# EAGLE design KMO_IO_M (EAGLE 9.1.3)
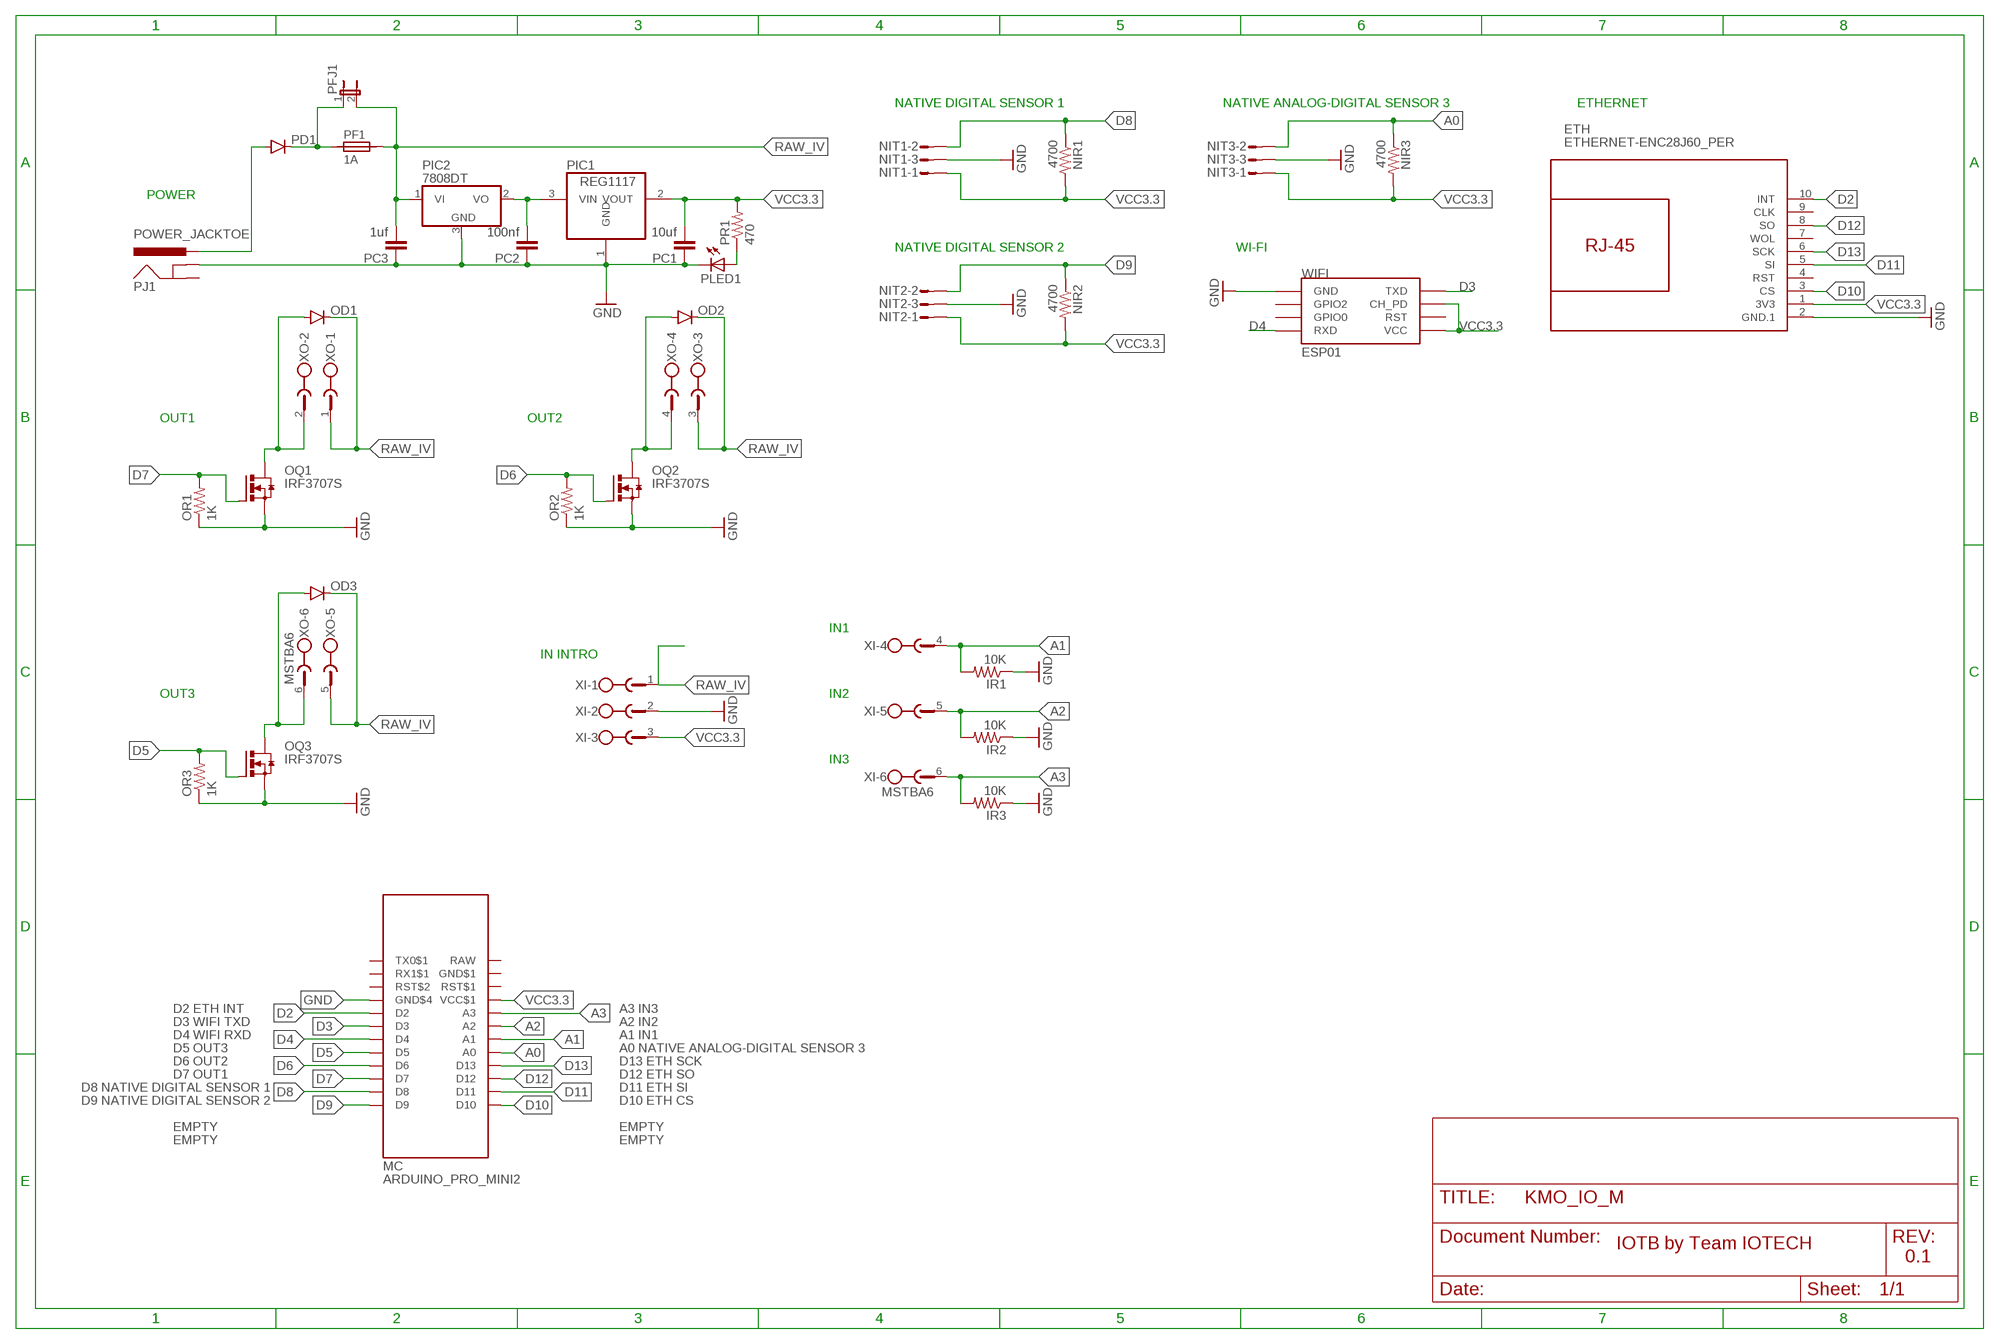
[diagram p0: schematic, sheet 1]

## Parts
ETH  ETHERNET-ENC28J60_PER  [ETHERNET-ENC28J60_PER]
IR1  10K  RESISTOR0805-RES  [0805]
IR2  10K  RESISTOR0805-RES  [0805]
IR3  10K  RESISTOR0805-RES  [0805]
MC  ARDUINO_PRO_MINI2  [ARDUINO_PRO_MINI2]
NIR1  4700  RESISTOR0805-RES  [0805]
NIR2  4700  RESISTOR0805-RES  [0805]
NIR3  4700  RESISTOR0805-RES  [0805]
NIT1  S03P  [S03P]
NIT2  S03P  [S03P]
NIT3  S03P  [S03P]
OD1  DIODESMA  [SMA-DIODE]
OD2  DIODESMA  [SMA-DIODE]
OD3  DIODESMA  [SMA-DIODE]
OQ1  IRF3707S  IRF3704S  [D2PACK]
OQ2  IRF3707S  IRF3704S  [D2PACK]
OQ3  IRF3707S  IRF3704S  [D2PACK]
OR1  1K  RESISTOR0805-RES  [0805]
OR2  1K  RESISTOR0805-RES  [0805]
OR3  1K  RESISTOR0805-RES  [0805]
PC1  10uf  CAP0805  [0805]
PC2  100nf  CAP0805  [0805]
PC3  1uf  CAP0805  [0805]
PD1  DIODESMA  [SMA-DIODE]
PF1  1A  SIBA194600  [1820]
PFJ1  JP1E  [JP1]
PIC1  REG1117  [SOT223]
PIC2  7808DT  [TO252]
PJ1  POWER_JACKTOE  [POWER_JACK_SMD_OVERPASTE_TOE]
PLED1  LEDCHIP-LED0805  [CHIP-LED0805]
PR1  470  RESISTOR0805-RES  [0805]
WIFI  ESP01  [ESP01]
XI  MSTBA6  [MSTBA6]
XO  MSTBA6  [MSTBA6]

## Nets
A0: MC.A0 NIR3.1 NIT3.2
A1: IR1.2 MC.A1 XI.4
A2: IR2.2 MC.A2 XI.5
A3: IR3.2 MC.A3 XI.6
D2: ETH.10(INT) MC.D2
D3: MC.D3 WIFI.TX(TXD)
D4: MC.D4 WIFI.RX(RXD)
D5: MC.D5 OQ3.1(G) OR3.2
D6: MC.D6 OQ2.1(G) OR2.2
D7: MC.D7 OQ1.1(G) OR1.2
D8: MC.D8 NIR1.1 NIT1.2
D9: MC.D9 NIR2.1 NIT2.2
D10: ETH.3(CS) MC.D10
D11: ETH.5(SI) MC.D11
D12: ETH.8(SO) MC.D12
D13: ETH.6(SCK) MC.D13
GND: ETH.2(GND.1) IR1.1 IR2.1 IR3.1 MC.GND$4 NIT1.3 NIT2.3 NIT3.3 OQ1.3(S) OQ2.3(S) OQ3.3(S) OR1.1 OR2.1 OR3.1 PC1.1 PC2.1 PC3.1 PIC1.1(GND) PIC2.3(GND) PJ1.GND(GNDBREAK) PLED1.C WIFI.GND XI.2
N$1: OD3.A OQ3.2(D) XO.6
N$2: PD1.C PF1.1 PFJ1.1
N$3: OD1.A OQ1.2(D) XO.2
N$4: OD2.A OQ2.2(D) XO.4
N$7: PD1.A PJ1.VIN0(PWR)
N$11: PLED1.A PR1.1
N$12: PC2.2 PIC1.3(VIN) PIC2.2(VO)
RAW_IV [v]: OD1.C OD2.C OD3.C PC3.2 PF1.2 PFJ1.2 PIC2.1(VI) XI.1 XO.1 XO.3 XO.5
VCC3.3: ETH.1(3V3) MC.VCC$1 NIR1.2 NIR2.2 NIR3.2 NIT1.1 NIT2.1 NIT3.1 PC1.2 PIC1.2(VOUT) PR1.2 WIFI.CH_PD WIFI.VCC XI.3
Unconnected: ETH.4(RST) ETH.7(WOL) ETH.9(CLK) MC.RST$1 MC.RST$2 MC.RX1$1 MC.TX0$1 PJ1.P$4(GND) WIFI.GPIO0 WIFI.GPIO2 WIFI.RST

## Notes on the sheet
- NATIVE DIGITAL SENSOR 1 | NATIVE ANALOG-DIGITAL SENSOR 3 | ETHERNET
- POWER
- NATIVE DIGITAL SENSOR 2 | WI-FI
- OUT1 | OUT2
- IN1
- IN INTRO
- OUT3 | IN2
- IN3
- D2 ETH INT | A3 IN3
- D3 WIFI TXD | A2 IN2
- D4 WIFI RXD | A1 IN1
- D5 OUT3 | A0 NATIVE ANALOG-DIGITAL SENSOR 3
- D6 OUT2 | D13 ETH SCK
- D7 OUT1 | D12 ETH SO
- D8 NATIVE DIGITAL SENSOR 1 | D11 ETH SI
- D9 NATIVE DIGITAL SENSOR 2 | D10 ETH CS
- EMPTY | EMPTY
- EMPTY | EMPTY
- IOTB by Team IOTECH
- 0.1

## Power pins joined to a net without a drawn wire
GND$1: MC.GDN$1(GND$1)
RAW: MC.RAW

## Library data of the parts
ETH = personal_diy-modules:ETHERNET-ENC28J60_PER
IR1-IR3 NIR1-NIR3 OR1-OR3 PR1 = SparkFun-Passives:RESISTOR: Resistor Basic schematic elements and footprints for 0603, 1206, and PTH resistors.
MC = personal_srgPersonal:ARDUINO_PRO_MINI2
NIT1-NIT3 = con-amp-mt:S03P: AMP MT CONNECTOR; OC_FARNELL: unknown; OC_NEWARK: unknown
OD1-OD3 PD1 = SparkFun-DiscreteSemi:DIODE: Diode These are standard reverse protection diodes and small signal diodes. SMA package can handle up to about 1A. SOD-323 can handle about 200mA. What the SOD-323 package when ordering, there are some mfgs out there that are 5-pin packages.
OQ1-OQ3 = transistor-power:IRF3704: SMPS MOSFET HEXFET® Power MOSFET Source: http://www.irf.com/product-info/datasheets/data/irf3704.pdf
PC1-PC3 = SparkFun-Capacitors:CAP: Capacitor Standard 0603 ceramic capacitor, and 0.1" leaded capacitor.
PF1 = _hhn_PtcFuses_Siba_r500_Ozan:SIBA194600*: SIBA PTC-Fuses, Series 194600, 1812 (4.5 3.2)mm Source: www.siba.de/ Package: SMD 1812 (4.5 x 3.2)mm Technologies: SIBA194600Axxx xxx: Trip-Current * 10 mA Author: Dipl.-Ing. FH Rainer Bayer
PFJ1 = jumper:JP1E: JUMPER
PIC1 = burr-brown:REG1117: 800mA and 1A Low Dropout (LDO) Positive Regulator 1.8V, 2.5V, 2.85V, 3.3V, 5V, and Adj; MPN: REG1117; OC_FARNELL: 1097566; OC_NEWARK: 14P6981
PIC2 = linear:78*: Positive VOLTAGE REGULATOR Source: http://cache.national.com/ds/LM/LM78L05.pdf http://www.fairchildsemi.com/ds/LM/LM7805.pdf
PJ1 = SparkFun-Connectors:POWER_JACK: Power Jack Connector This is the standard 5.5mm barrel jack for power. The PTH is the most common, proven, reliable, footprint. The Slot footprint only works if the mill layer is transmitted to the PCB fab house so be warned. Here are the connectors we sell at SparkFun: DC Barrel Power Jack/Connector <https://www.sparkfun.com/products/119> (PRT-00119) DC Barrel Power Jack/Connector (SMD) <https://www.sparkfun.com/products/12748> (PRT-12748) DC Barrel Jack Adapter - Breadboard Compatible <https://www.sparkfun.com/products/10811> (PRT-10811) It is used on this SparkFun product (and many, many others): SparkFun RedBoard - Programmed with Arduino <https://www.sparkfun.com/products/12757> (DEV-12757) Also, if you need a mating power supply or connector, please check these out: Wall Adapter Power Supply - 9VDC 650mA <https://www.sparkfun.com/products/298> (TOL-00298) DC Barrel Jack Adapter - Male <https://www.sparkfun.com/products/10287> (PRT-10287); PROD_ID: CONN-08106; SF_ID: PRT-12748
PLED1 = led:LED: LED OSRAM: - CHIPLED LG R971, LG N971, LY N971, LG Q971, LY Q971, LO R971, LY R971 LH N974, LH R974 LS Q976, LO Q976, LY Q976 LO Q996 - Hyper CHIPLED LW Q18S LB Q993, LB Q99A, LB R99A - SideLED LS A670, LO A670, LY A670, LG A670, LP A670 LB A673, LV A673, LT A673, LW A673 LH A674 LY A675 LS A676, LA A676, LO A676, LY A676, LW A676 LS A679, LY A679, LG A679 - Hyper Micro SIDELED® LS Y876, LA Y876, LO Y876, LY Y876 LT Y87S - SmartLED LW L88C, LW L88S LB L89C, LB L89S, LG L890 LS L89K, LO L89K, LY L89K LS L896, LA L896, LO L896, LY L896 - TOPLED LS T670, LO T670, LY T670, LG T670, LP T670 LSG T670, LSP T670, LSY T670, LOP T670, LYG T670 LG T671, LOG T671, LSG T671 LB T673, LV T673, LT T673, LW T673 LH T674 LS T676, LA T676, LO T676, LY T676, LB T676, LH T676, LSB T676, LW T676 LB T67C, LV T67C, LT T67C, LS T67K, LO T67K, LY T67K, LW E67C LS E67B, LA E67B, LO E67B, LY E67B, LB E67C, LV E67C, LT E67C LW T67C LS T679, LY T679, LG T679 LS T770, LO T770, LY T770, LG T770, LP T770 LB T773, LV T773, LT T773, LW T773 LH T774 LS E675, LA E675, LY E675, LS T675 LS T776, LA T776, LO T776, LY T776, LB T776 LHGB T686 LT T68C, LB T68C - Hyper Mini TOPLED® LB M676 - Mini TOPLED Santana® LG M470 LS M47K, LO M47K, LY M47K Source: http://www.osram.convergy.de LUXEON: - LUMILED® LXK2-PW12-R00, LXK2-PW12-S00, LXK2-PW14-U00, LXK2-PW14-V00 LXK2-PM12-R00, LXK2-PM12-S00, LXK2-PM14-U00 LXK2-PE12-Q00, LXK2-PE12-R00, LXK2-PE12-S00, LXK2-PE14-T00, LXK2-PE14-U00 LXK2-PB12-K00, LXK2-PB12-L00, LXK2-PB12-M00, LXK2-PB14-N00, LXK2-PB14-P00, LXK2-PB14-Q00 LXK2-PR12-L00, LXK2-PR12-M00, LXK2-PR14-Q00, LXK2-PR14-R00 LXK2-PD12-Q00, LXK2-PD12-R00, LXK2-PD12-S00 LXK2-PH12-R00, LXK2-PH12-S00 LXK2-PL12-P00, LXK2-PL12-Q00, LXK2-PL12-R00 Source: www.luxeon.com KINGBRIGHT: KA-3528ASYC Source: www.kingbright.com
WIFI = esp8266modules:ESP01: ESP8266 Wifi module 01
XI XO = con-phoenix-508:MSTBA6: PHOENIX; MF: FARNELL; MPN: 1757284; OC_FARNELL: 3705213; OC_NEWARK: 71C4165

## Net classes
0 default: width 0.3 mm, drill 0.5 mm, clearance 0.25 mm
1 v: width 0.3 mm, drill 0.5 mm, clearance 0.25 mm

## Board
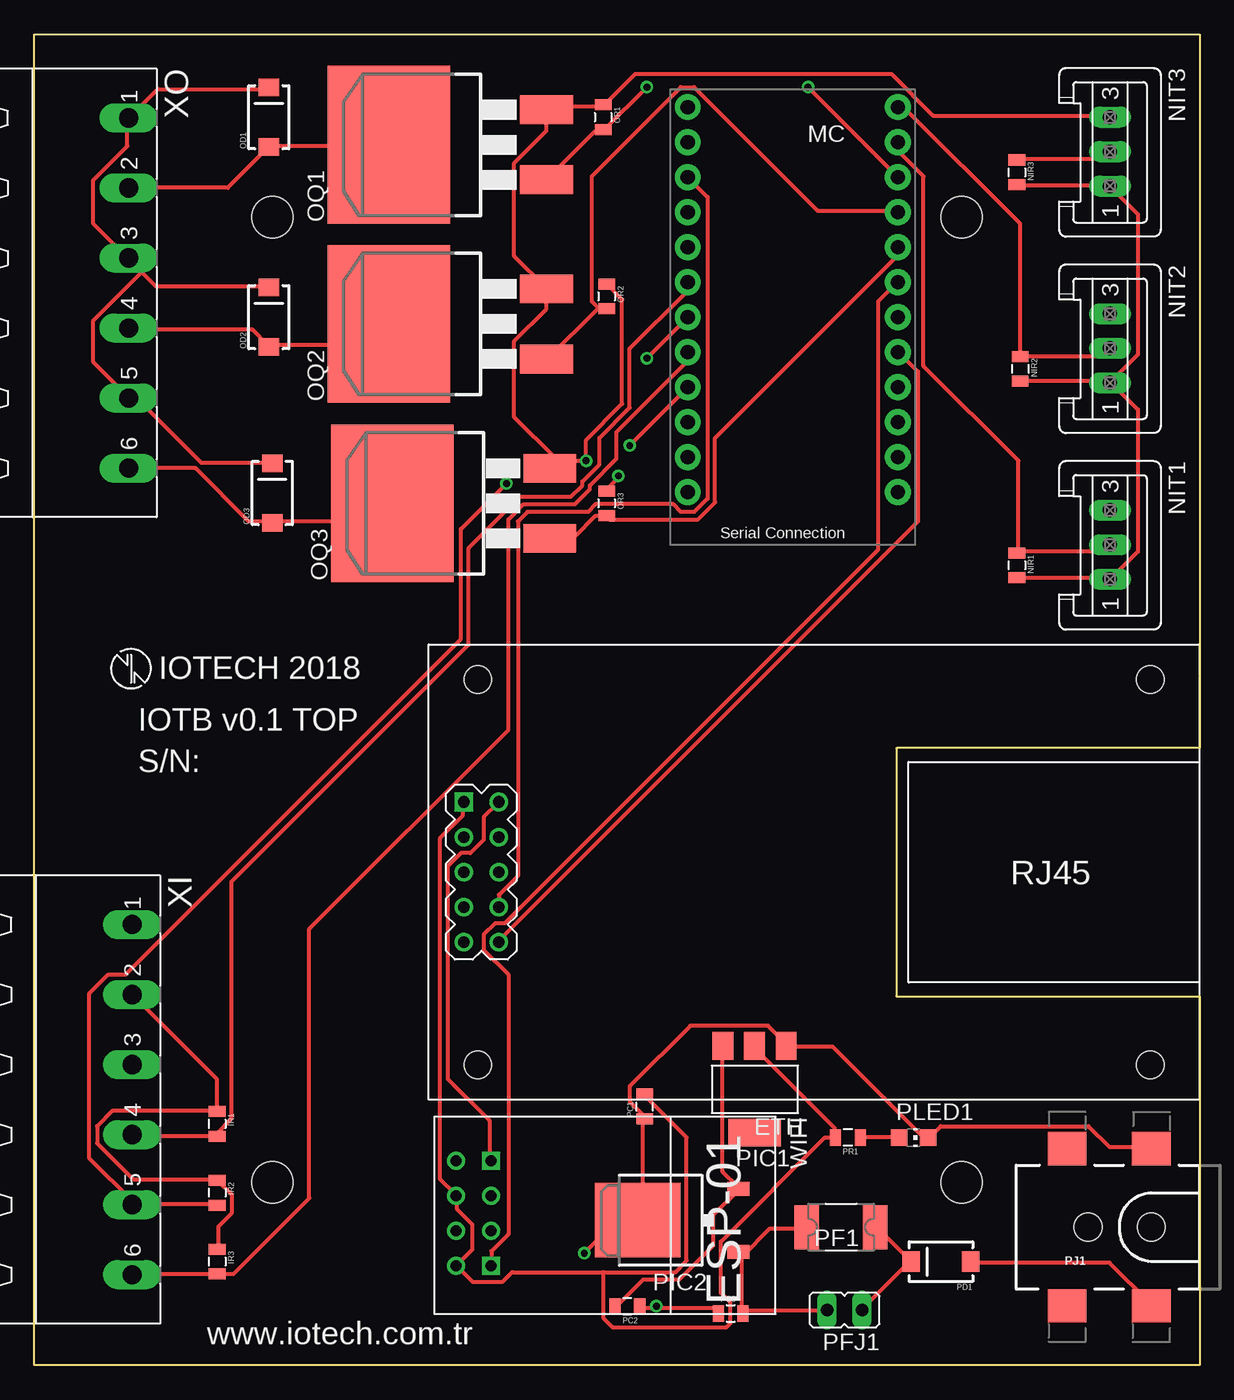
[diagram p1: board, top side]
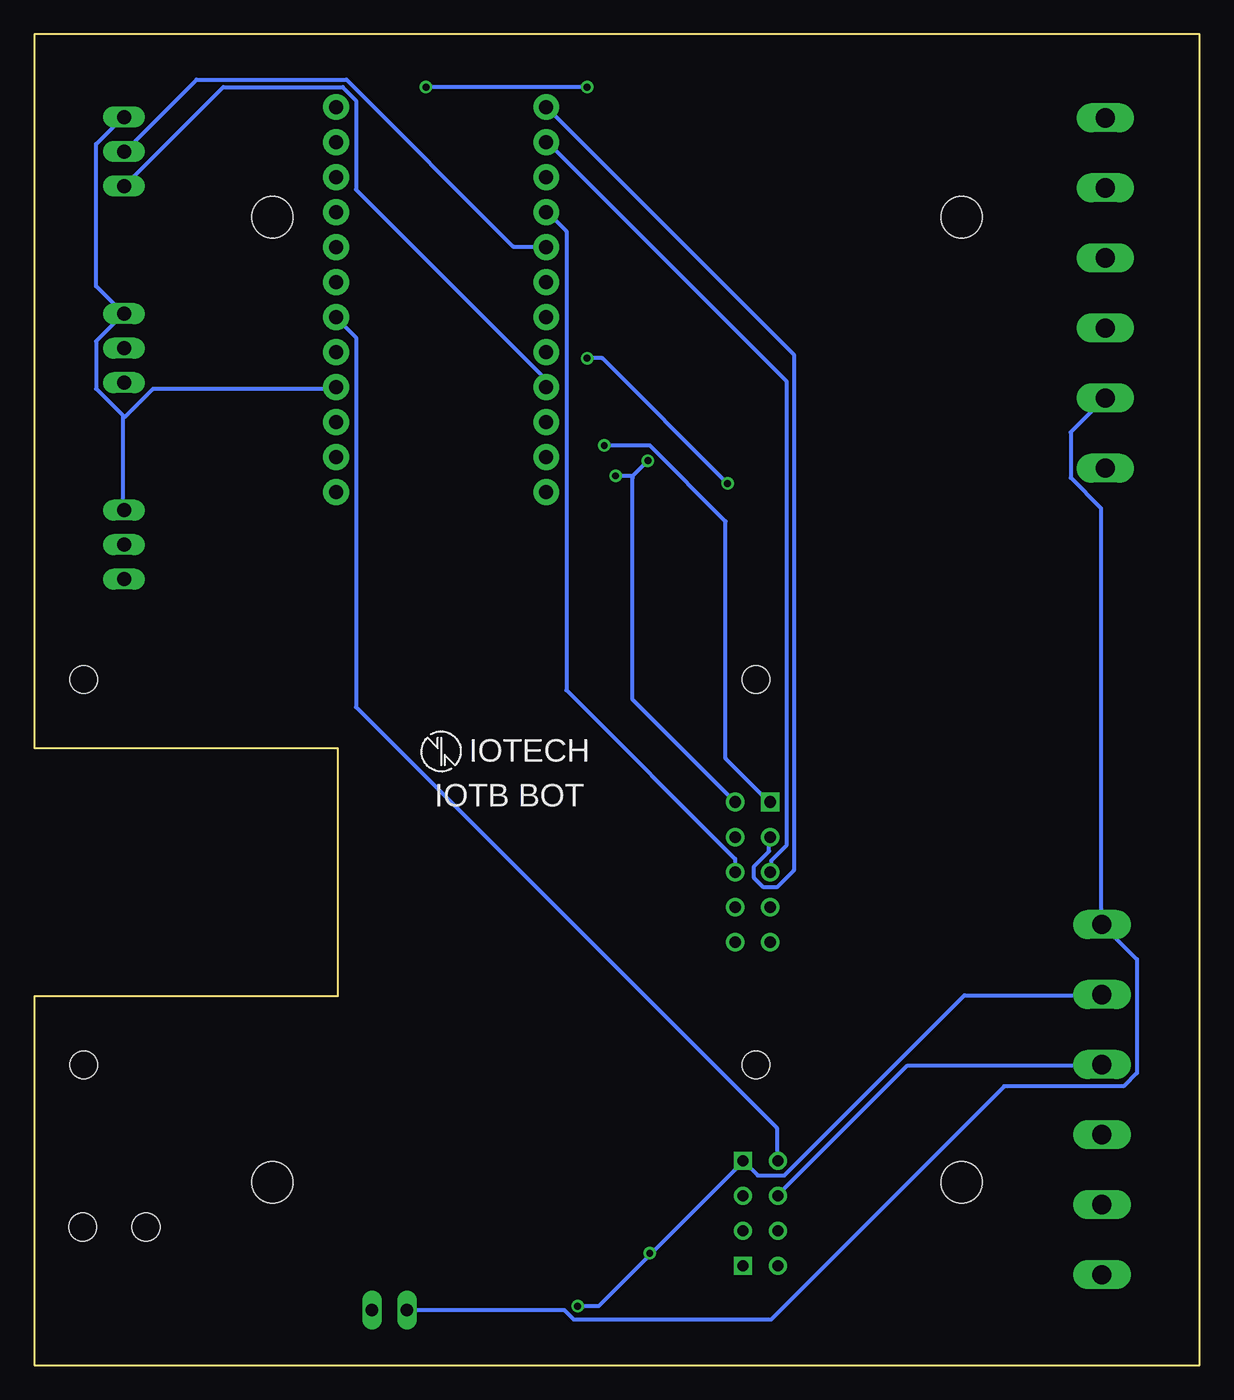
[diagram p2: board, bottom side, seen from below]

Size 84.5 x 96.5 mm. Coordinates in mm from the lower left corner, seen from the top.
Outline: 0,0 0,96.5 84.5,96.5 84.5,50 84.5,44.75 62.5,44.75 62.5,26.75 84.5,26.75 84.5,0 0,0
Copper layers (1*16): Top 0.035mm / dielectric 1.5mm / Bottom 0.035mm
Design rules "KMO_IO_M": minimum track width 6mil, minimum drill 0.35mm, track to track 0.205mm, track to pad 0.205mm, pad to pad 0.205mm, via to via 0.205mm, smd to smd 6mil, copper to edge 40mil, drill to drill 6mil, minimum pad ring 10mil, minimum via ring 8mil, stop-mask expansion 4mil, vias tented up to drill 0mil, thermal gap 10mil
Holes 3 mm at 17.25,83.25 67.25,83.25 17.25,13.25 67.25,13.25

### Footprints (pad centres in the part's own frame; a part is rotated, then mirrored left to right if it is on the bottom)
ETHERNET-ENC28J60_PER = drill 0.85 square: 1 22.86,-5.08 | drill 0.85: 2 20.32,-5.08; 3 22.86,-2.54; 4 20.32,-2.54; 5 22.86,0; 6 20.32,0; 7 22.86,2.54; 8 20.32,2.54; 9 22.86,5.08; 10 20.32,5.08 | hole 2: -26.924,13.97; 21.844,13.97; -26.924,-13.97; 21.844,-13.97
0805 = smd 0.8 x 1.2: 1 -0.9,0; 2 0.9,0
ARDUINO_PRO_MINI2 = drill 1.016 pad 1.88: A0 7.62,-5.08; A1 7.62,-2.54; A2 7.62,0; A3 7.62,2.54; D2 -7.62,2.54; D3 -7.62,0; D4 -7.62,-2.54; D5 -7.62,-5.08; D6 -7.62,-7.62; D7 -7.62,-10.16; D8 -7.62,-12.7; D9 -7.62,-15.24; D10 7.62,-15.24; D11 7.62,-12.7; D12 7.62,-10.16; D13 7.62,-7.62; GDN$1 7.62,10.16; GND$4 -7.62,5.08; RAW 7.62,12.7; RST$1 7.62,7.62; RST$2 -7.62,7.62; RX1$1 -7.62,10.16; TX0$1 -7.62,12.7; VCC$1 7.62,5.08
S03P = drill 1.016 long: 1 2.5,0; 2 0,0; 3 -2.5,0
SMA-DIODE = smd 1.27 x 1.47: A -2.15,0; C 2.15,0
D2PACK = smd 2.083 x 3.81: 1 -2.54,-8.89; 3 2.54,-8.89 | smd 11.43 x 8.89: 2 0,2.54
1820 = smd 1.78 x 3.2: 1 -2.49,0; 2 2.49,0
JP1 = drill 0.914 long: 1 0,-1.27; 2 0,1.27
SOT223 = smd 1.499 x 2.007: 1 -2.261,-3.15; 2 0.025,-3.15; 3 2.311,-3.15 | smd 3.81 x 2.007: 4 0,3.15
TO252 = smd 1 x 1.6: 1 -2.28,-4.8; 2 2.28,-4.8 | smd 5.4 x 6.2: 3 0,2.5
POWER_JACK_SMD_OVERPASTE_TOE = smd 2.8 x 2.4: GND 0,-5.7; P$4 6.1,-5.7; VIN0 0,5.7; VIN1 6.1,5.7 | hole 2.032: 0,0; 4.572,0
CHIP-LED0805 = smd 1.2 x 1.2: A 0,-1.05; C 0,1.05
ESP01 = drill 0.8: CH_PD -1.285,-8.178; GPIO0 1.255,-5.638; GPIO2 -1.285,-5.638; RST 1.255,-8.178; TX -3.825,-8.178; VCC 3.795,-8.178 | drill 0.8 square: GND -3.825,-5.638; RX 3.795,-5.638
MSTBA6 = drill 1.397 long: 1 -12.7,5.08; 2 -7.62,5.08; 3 -2.54,5.08; 4 2.54,5.08; 5 7.62,5.08; 6 12.7,5.08

### Placement (x,y rotation side)
ETH  54,35.75 180 top
IR1  13.25,17.5 270 top
IR2  13.25,12.5 270 top
IR3  13.25,7.5 270 top
MC  55,76 180 top
NIR1  71.25,58 270 top
NIR2  71.5,72.25 270 top
NIR3  71.25,86.5 270 top
NIT1  78,59.5 270 top
NIT2  78,73.75 270 top
NIT3  78,88 270 top
OD1  17,90.5 90 top
OD2  17,76 90 top
OD3  17.25,63.25 90 top
OQ1  28.25,88.5 90 top
OQ2  28.25,75.5 90 top
OQ3  28.5,62.5 90 top
OR1  41.25,90.5 270 top
OR2  41.5,77.5 270 top
OR3  41.5,62.5 270 top
PC1  44.25,18.75 90 top
PC2  43,4.25 180 top
PC3  50.5,3.75 0 top
PD1  65.75,7.5 180 top
PF1  58.5,10 180 top
PFJ1  58.75,4 90 top
PIC1  52.25,20 180 top
PIC2  46.25,10.5 90 top
PJ1  81,10 180 top
PLED1  63.75,16.5 270 top
PR1  59,16.5 180 top
WIFI  38.75,11 270 top
XI  2,19.25 270 top
XO  1.75,77.75 270 top

### Tracks (layer width: path | path; a pad name or v marks a point on that pad's centre or on a via)
A0
  Top 0.3: NIR3.1 71.36,87.45 77.41,87.45 77.96,88 NIT3.2
  Bottom 0.3: MC.A0 47.44,81.12 49.77,81.12 61.88,93.22 72.74,93.22 77.96,88 NIT3.2
A1
  Top 0.3: XI.4 7.15,16.64 13.2,16.64 IR1.2 13.2,16.77 14.3,17.88 14.3,35.06 31.49,52.25 31.49,59.26 35.2,62.98 38.91,62.98 39.74,63.8 39.74,64.08 40.98,65.31 40.98,67.24 43.17,69.44 43.17,73.7 47.3,77.83 47.3,78.51 MC.A1
A2  (via drill 0.5)
  Top 0.3: IR2.2 13.2,11.69 7.15,11.69 XI.5 7.15,11.82 3.99,14.99 3.99,26.95 5.36,28.32 6.6,28.32 30.94,52.66 30.94,60.64 v34.24,63.94 | v44.41,73.01 47.3,75.9 MC.A2
  Bottom 0.3: v44.41,73.01 43.31,73.01 v34.24,63.94
A3
  Top 0.3: XI.6 7.15,6.6 13.2,6.6 IR3.2 13.34,6.6 14.44,6.6 19.94,12.1 19.94,31.62 34.38,46.06 34.38,61.33 35.48,62.42 39.19,62.42 40.29,63.52 40.29,63.8 42.21,65.72 42.21,67.65 47.3,72.74 47.3,73.42 MC.A3
D2
  Top 0.3: ETH.10 33.69,30.8 64.08,61.19 64.08,72.05 62.7,73.42 MC.D2
D3
  Bottom 0.3: WIFI.TX 30.66,14.85 30.66,17.19 61.19,47.71 61.19,74.53 62.56,75.9 MC.D3
D4
  Top 0.3: WIFI.RX 33.14,7.29 33.14,8.25 34.38,9.49 34.38,28.32 32.59,30.11 32.59,31.21 33.41,32.04 34.1,32.04 61.19,59.12 61.19,77.14 62.56,78.51 MC.D4
D5
  Top 0.3: OQ3.1 37.4,60.09 39.19,60.09 40.7,61.6 41.39,61.6 OR3.2 41.52,61.46 41.66,61.33 48.12,61.33 49.36,62.56 49.36,67.24 62.56,80.44 62.56,80.99 MC.D5
D6
  Top 0.3: 40.84,76.59 41.39,76.59 OR2.2 | 40.84,76.59 37.26,73.01 OQ2.1 | MC.D6 62.56,83.74 56.79,83.74 47.85,92.67 46.89,92.67 40.42,86.21 40.42,77.14 40.84,76.72 40.84,76.59
D7  (via drill 0.5)
  Top 0.3: OQ1.1 37.26,86.08 40.7,89.51 41.25,89.51 OR1.2 41.39,89.65 v44.41,92.67 | v56.1,92.67 62.56,86.21 MC.D7
  Bottom 0.3: v44.41,92.67 v56.1,92.67
D8
  Top 0.3: NIT1.2 77.96,59.4 77.55,58.99 71.36,58.99 NIR1.1 71.36,59.12 71.36,65.59 64.49,72.46 64.49,86.21 62.7,88 62.7,88.69 MC.D8
D9
  Top 0.3: NIT2.2 77.96,73.7 77.41,73.15 NIR2.1 71.5,73.29 71.5,82.78 63.11,91.16 62.7,91.16 MC.D9
D10
  Bottom 0.3: ETH.3 31.21,38.23 31.21,37.26 32.31,36.16 32.31,35.34 31.62,34.65 30.66,34.65 29.43,35.89 29.43,73.29 47.3,91.16 MC.D10
D11
  Bottom 0.3: ETH.5 31.07,35.75 31.07,36.58 29.98,37.67 29.98,71.36 47.3,88.69 MC.D11
D12
  Top 0.3: ETH.8 33.69,33.27 33.69,34.1 35.06,35.48 35.06,61.19 35.75,61.88 40.15,61.88 40.7,62.42 46.34,62.42 46.89,61.88 47.85,61.88 48.81,62.84 48.81,84.7 47.44,86.08 MC.D12
D13
  Bottom 0.3: ETH.6 33.69,36.71 45.92,48.95 45.92,82.22 47.3,83.6 MC.D13
GND  (via drill 0.5)
  Top 0.3: PJ1.GND 80.99,15.81 77.96,15.81 76.45,17.32 65.72,17.32 64.9,16.5 PLED1.C 64.76,16.5 64.49,16.5 57.89,23.1 54.59,23.1 PIC1.1 54.59,23.24 53.21,24.61 47.58,24.61 43.17,20.21 43.17,19.11 44.14,18.15 44.14,17.88 PC1.1 44.14,17.74 44.14,10.86 43.86,10.59 PIC2.3 43.73,10.45 42.21,10.45 v39.88,8.11 | v42.35,64.49 42.35,64.35 41.52,63.52 OR3.1 | OR2.1 41.52,78.38 42.62,77.28 42.62,69.71 40.01,67.1 40.01,65.72 v40.01,65.59 37.81,65.59 37.4,65.17 OQ3.3 37.81,65.72 34.79,68.75 34.79,74.25 37.12,76.59 37.12,77.96 OQ2.3 37.12,78.1 34.79,80.44 34.79,87.17 37.12,89.51 37.12,91.03 OQ1.3 37.26,91.16 37.4,91.3 41.25,91.3 OR1.1 41.39,91.44 43.59,93.64 62.15,93.64 65.17,90.61 77.96,90.61 NIT3.3 | IR3.1 13.34,8.53 13.34,10.04 14.3,11 14.3,12.38 13.34,13.34 IR2.1 13.2,13.47 7.15,13.47 4.54,16.09 4.54,17.32 5.64,18.43 13.06,18.43 IR1.1 13.2,18.43 13.2,20.76 7.15,26.81 XI.2 | 45.1,4.12 49.23,4.12 49.5,3.85 PC3.1 | 45.1,4.12 44,4.12 PC2.1 | WIFI.GND 33,14.85 33,17.74 29.98,20.76 29.98,36.16 30.94,37.12 31.62,37.12 32.59,38.09 32.59,39.74 33.55,40.7 ETH.2 | v45.1,4.26 45.1,4.12
  Bottom 0.3: 78.1,68.75 78.1,68.89 80.03,70.81 80.03,74.25 78.1,76.17 NIT2.3 78.1,76.31 80.03,78.24 80.03,88.55 78.1,90.47 NIT3.3 | 78.1,68.75 78.1,62.01 NIT1.3 | MC.GND$4 62.7,70.81 75.9,70.81 77.96,68.75 78.1,68.75 | 41.11,64.49 v42.35,64.49 | v40.01,65.59 41.11,64.49 | v45.1,4.26 43.59,4.26 39.81,8.04 | 39.81,8.04 33.14,14.71 WIFI.GND 33,14.71 32.04,13.75 30.11,13.75 17.05,26.81 7.15,26.81 XI.2 | 41.11,64.49 41.11,64.35 41.11,48.26 ETH.2 | v39.88,8.11 39.81,8.04
N$1
  Top 0.3: OQ3.2 25.85,62.42 24.61,61.19 17.32,61.19 OD3.A 17.19,61.19 15.54,61.19 11.69,65.04 6.88,65.04 XO.6
N$2
  Top 0.3: 63.52,7.56 61.05,10.04 PF1.1 | 63.52,7.56 PD1.C 63.52,7.56 | 63.52,7.56 60.09,4.12 PFJ1.1
N$3
  Top 0.3: OQ1.2 25.57,88.41 17.05,88.41 OD1.A 16.91,88.28 14.03,85.39 6.88,85.39 XO.2
N$4
  Top 0.3: OQ2.2 25.57,75.49 24.06,73.97 17.05,73.97 OD2.A 16.91,73.97 15.81,75.08 6.88,75.08 XO.4
N$7
  Top 0.3: PD1.A 67.92,7.42 77.96,7.42 80.99,4.4 PJ1.VIN0
N$11
  Top 0.3: PLED1.A 59.95,16.5 PR1.1
N$12
  Top 0.3: PC2.2 42.21,4.26 44.14,6.19 46.75,6.19 49.23,8.66 49.23,10.86 51.01,12.65 PIC2.2 51.01,12.93 49.91,14.03 49.91,23.1 PIC1.3
RAW_IV
  Top 0.3: OD1.C 16.91,92.54 8.94,92.54 6.88,90.47 XO.1 6.74,90.34 6.74,88.41 4.26,85.94 4.26,82.78 6.74,80.3 XO.3 6.88,80.16 7.77,79.27 | 7.77,79.27 8.8,78.24 16.91,78.24 OD2.C | PFJ1.2 57.48,3.99 51.42,3.99 PC3.2 51.29,3.85 51.29,7.97 51.15,8.11 PIC2.1 51.42,7.97 53.35,9.9 55.96,9.9 PF1.2 | OD3.C 17.19,65.45 12.1,65.45 7.42,70.12 6.88,70.12 XO.5 6.74,70.26 4.26,72.74 4.26,75.76 7.7,79.2 7.77,79.27
  Bottom 0.3: XO.5 6.88,70.12 9.35,67.65 9.35,64.35 7.15,62.15 7.15,32.04 XI.1 7.01,31.9 4.54,29.43 4.54,21.18 5.5,20.21 14.16,20.21 31.07,3.3 45.38,3.3 46.06,3.99 57.48,3.99 PFJ1.2
VCC3.3  (via drill 0.5)
  Top 0.3: NIR1.2 71.36,57.06 77.96,57.06 NIT1.1 78.1,57.06 80.03,58.99 80.03,69.3 78.1,71.22 NIT2.1 | NIR2.2 71.5,71.36 77.96,71.36 NIT2.1 | NIR3.2 71.36,85.53 77.96,85.53 NIT3.1 78.1,85.39 80.03,83.46 80.03,73.29 78.1,71.36 NIT2.1 | PIC1.2 52.11,23.1 58.02,17.19 58.02,16.5 PR1.2 57.89,16.5 57.34,16.5 49.77,8.94 49.77,5.22 50.46,4.54 50.46,3.02 50.19,2.75 41.94,2.75 41.25,3.44 41.25,6.6 41.25,6.74 | 41.25,6.74 34.65,6.74 33.96,6.05 31.76,6.05 30.66,7.15 WIFI.VCC 30.66,7.29 31.76,8.39 31.76,10.18 30.66,11.28 30.66,12.24 WIFI.CH_PD 30.52,12.38 29.43,13.47 29.43,38.23 31.07,39.88 31.07,40.7 ETH.1 | 41.25,6.74 46.48,6.74 47.3,7.56 47.3,16.5 44.27,19.52 PC1.2 | v43.17,66.69 47.3,70.81 MC.VCC$1
  Bottom 0.3: MC.VCC$1 47.44,70.95 47.44,71.5 61.19,85.25 61.19,91.71 62.15,92.67 70.81,92.67 77.96,85.53 NIT3.1 | XI.3 7.15,21.73 21.18,21.73 30.52,12.38 WIFI.CH_PD | v43.17,66.69 39.88,66.69 34.38,61.19 34.38,44 31.21,40.84 ETH.1

### Text on the board
tPlace: IOTECH 2018 | IOTB v0.1 TOP | S/N: | www.iotech.com.tr
bPlace: IOTECH | IOTB BOT